# EAGLE schematic Gadget-Box-NodeMCU (EAGLE 6.6.0)

## Sheet 1 of 2
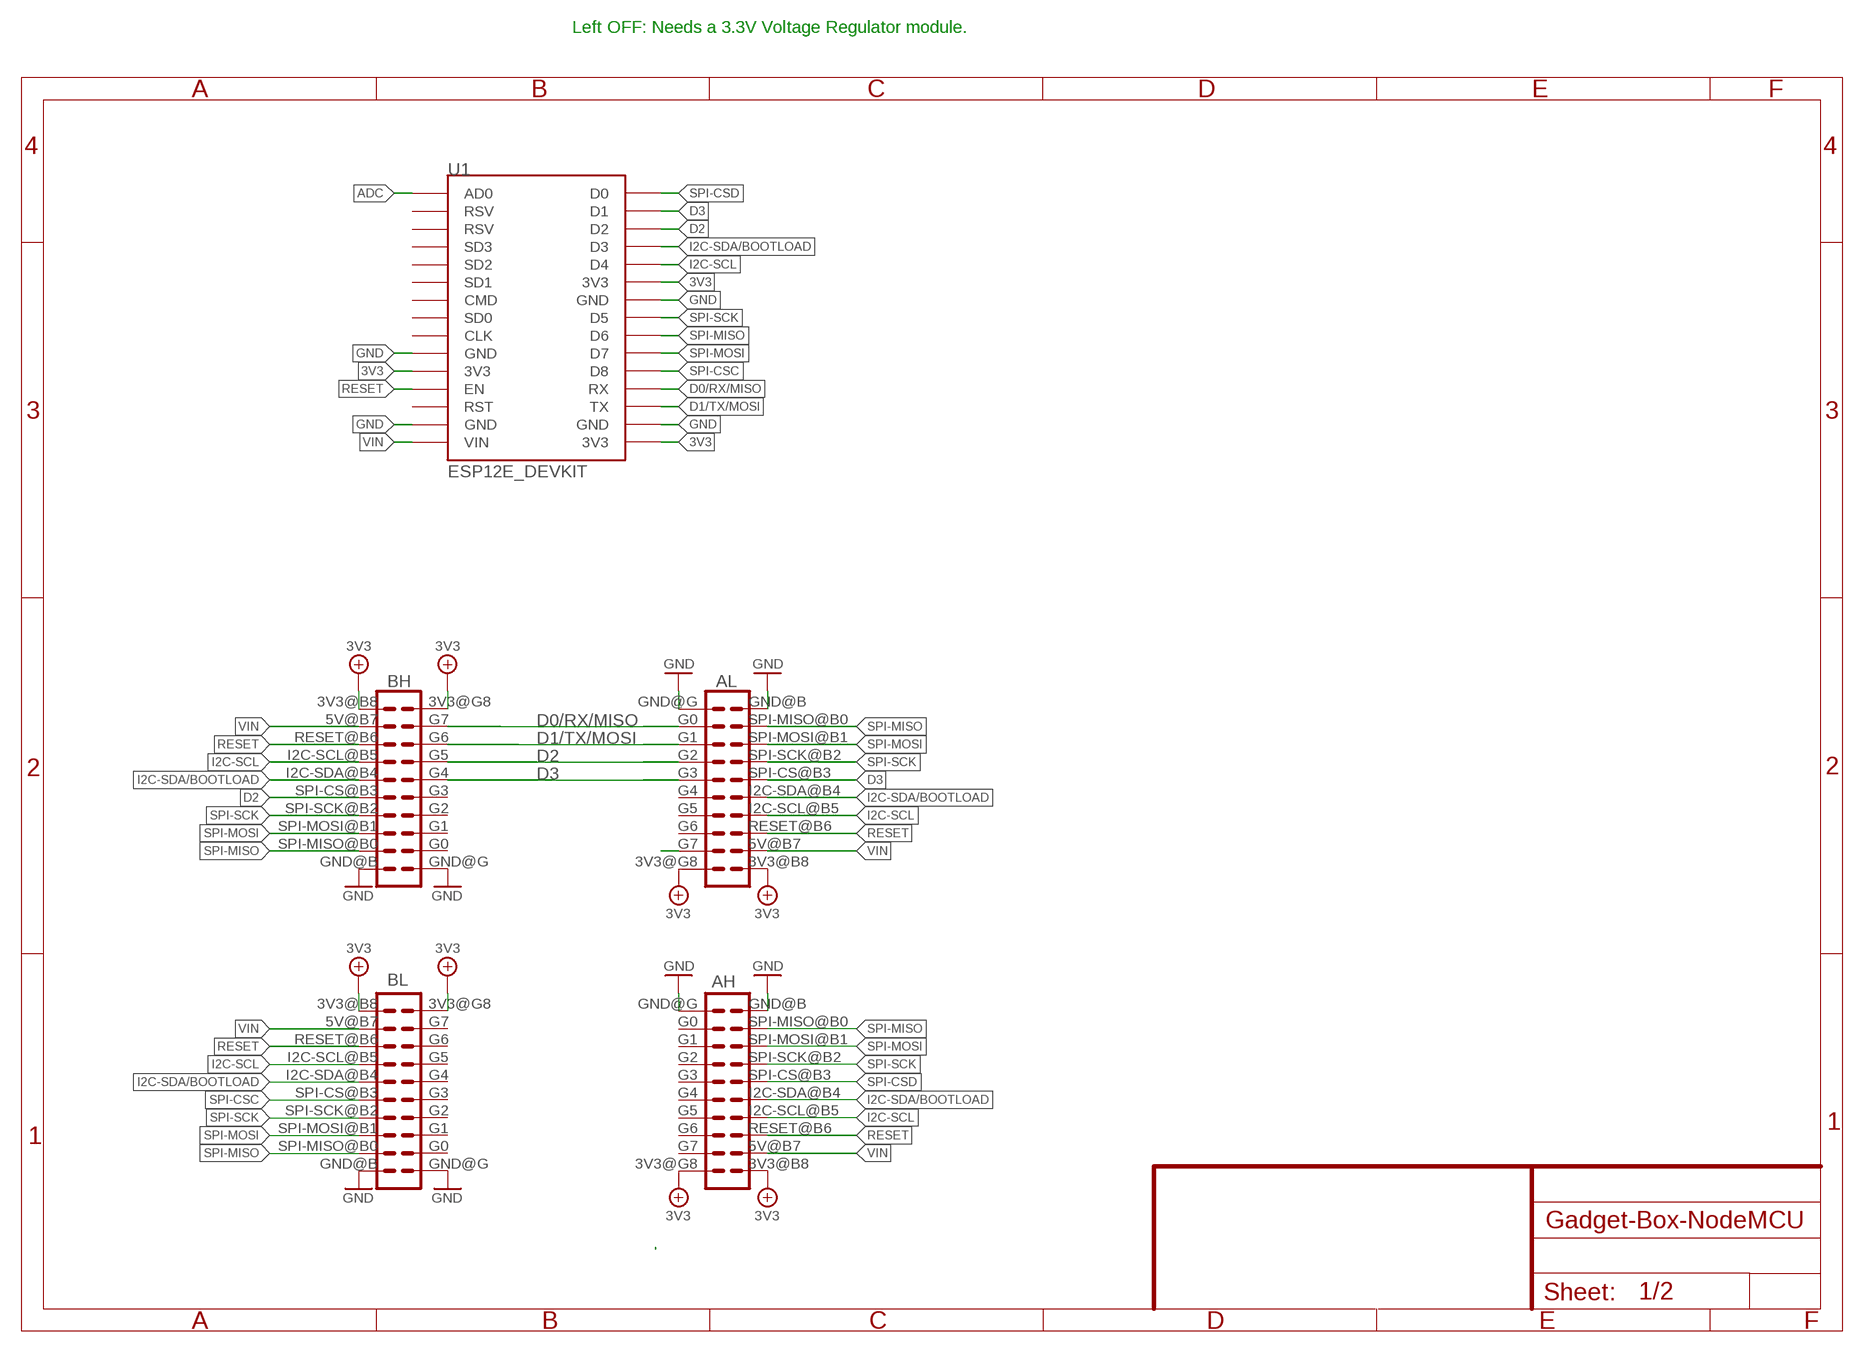
[diagram p0: schematic, sheet 1]

### Parts
AH  ECOGECOG_SLOT  [ECOG]
AL  ECOGECOG_SLOT  [ECOG]
BH  ECOGECOG_SLOT  [ECOG]
BL  ECOGECOG_SLOT  [ECOG]
U1  ESP12E_DEVKIT  [ESP12E_DEVKIT]

### Nets
3V3: AH.3V3@B8(3V3) AH.3V3@G8(3V3) AL.3V3@B8(3V3) AL.3V3@G8(3V3) BH.3V3@B8(3V3) BH.3V3@G8(3V3) BL.3V3@B8(3V3) BL.3V3@G8(3V3) U1.3V3@0(3V3) U1.3V3@1(3V3) U1.3V3@2(3V3)
ADC: U1.AD0 ; also sheet 2
D0/RX/MISO: AL.G0 BH.G7 U1.RX
D1/TX/MOSI: AL.G1 BH.G6 U1.TX
D2: AL.G2 BH.G5 BH.SPI-CS@B3(SPI-CS) U1.D2
D3: AL.G3 AL.SPI-CS@B3(SPI-CS) BH.G4 U1.D1
GND [gnd]: AH.GND@B(GND) AH.GND@G(GND) AL.GND@B(GND) AL.GND@G(GND) BH.GND@B(GND) BH.GND@G(GND) BL.GND@B(GND) BL.GND@G(GND) U1.GND@0(GND) U1.GND@1(GND) U1.GND@2(GND) U1.GND@3(GND) ; also sheet 2
I2C-SCL: AH.I2C-SCL@B5(I2C-SCL) AL.I2C-SCL@B5(I2C-SCL) BH.I2C-SCL@B5(I2C-SCL) BL.I2C-SCL@B5(I2C-SCL) U1.D4
I2C-SDA/BOOTLOAD: AH.I2C-SDA@B4(I2C-SDA) AL.I2C-SDA@B4(I2C-SDA) BH.I2C-SDA@B4(I2C-SDA) BL.I2C-SDA@B4(I2C-SDA) U1.D3
N$5: AL.G7
RESET: AH.RESET@B6(RESET) AL.RESET@B6(RESET) BH.RESET@B6(RESET) BL.RESET@B6(RESET) U1.EN
SPI-CSC: BL.SPI-CS@B3(SPI-CS) U1.D8
SPI-CSD: AH.SPI-CS@B3(SPI-CS) U1.D0
SPI-MISO: AH.SPI-MISO@B0(SPI-MISO) AL.SPI-MISO@B0(SPI-MISO) BH.SPI-MISO@B0(SPI-MISO) BL.SPI-MISO@B0(SPI-MISO) U1.D6
SPI-MOSI: AH.SPI-MOSI@B1(SPI-MOSI) AL.SPI-MOSI@B1(SPI-MOSI) BH.SPI-MOSI@B1(SPI-MOSI) BL.SPI-MOSI@B1(SPI-MOSI) U1.D7
SPI-SCK: AH.SPI-SCK@B2(SPI-SCK) AL.SPI-SCK@B2(SPI-SCK) BH.SPI-SCK@B2(SPI-SCK) BL.SPI-SCK@B2(SPI-SCK) U1.D5
VIN: AH.5V@B7(5V) AL.5V@B7(5V) BH.5V@B7(5V) BL.5V@B7(5V) U1.VIN ; also sheet 2
Unconnected: AH.G0 AH.G1 AH.G2 AH.G3 AH.G4 AH.G5 AH.G6 AH.G7 AL.G4 AL.G5 AL.G6 BH.G0 BH.G1 BH.G2 BH.G3 BL.G0 BL.G1 BL.G2 BL.G3 BL.G4 BL.G5 BL.G6 BL.G7 U1.CLK U1.CMD U1.RST U1.RSV@0(RSV) U1.RSV@1(RSV) U1.SD0 U1.SD1 U1.SD2 U1.SD3

### Notes on the sheet
- Left OFF: Needs a 3.3V Voltage Regulator module.

## Sheet 2 of 2
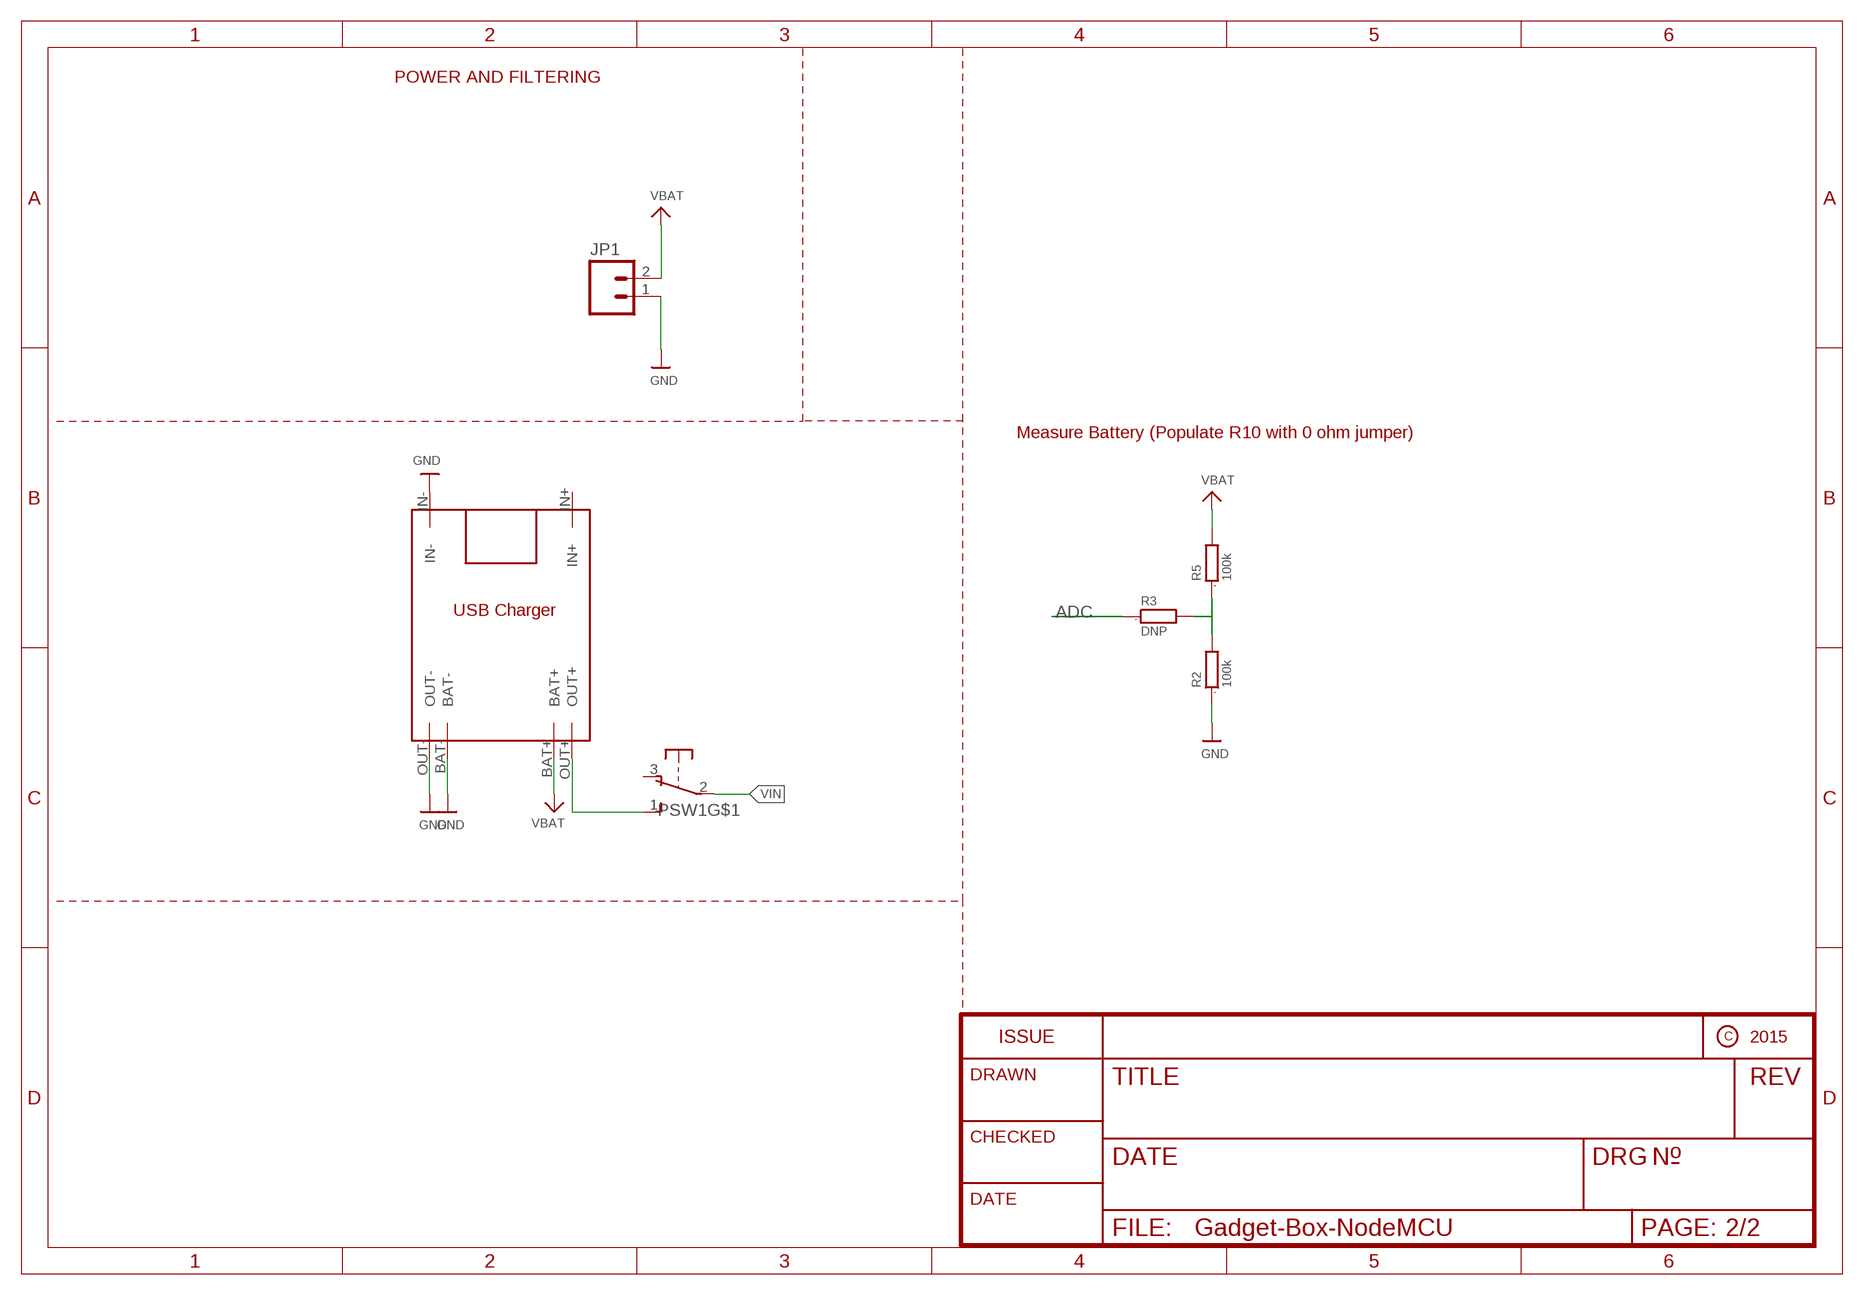
[diagram p1: schematic, sheet 2]

### Parts
JP1  M02-JST-2-PTH-NO_SILK  [JST-2-PTH-NS]
PSW1  OS102011MA1Q  [OS102011MA1Q]
R2  100k  R0603  [0603]
R3  DNP  R0603  [0603]
R5  100k  R0603  [0603]
U$1  TP4056  [TP4056]

### Nets
ADC: R3.1 ; also sheet 1
GND [gnd]: JP1.1 R2.1 U$1.BAT- U$1.IN- U$1.OUT- ; also sheet 1
N$2: R2.2 R3.2 R5.1
N$3: PSW1.1(S) U$1.OUT+
VBAT: JP1.2 R5.2 U$1.BAT+
VIN: PSW1.2(P) ; also sheet 1
Unconnected: PSW1.3(O) PSW1.MT1(MT) PSW1.MT2(MT) U$1.IN+

### Notes on the sheet
- POWER AND FILTERING
- Measure Battery (Populate R10 with 0 ohm jumper)

## Library data of the parts
AH AL BH BL = eCogs:ECOG; PARTNO: PPPC102LFBN-RC,SULLINS CONNECTOR SOLUTIONS,dk,S6106-ND,"CONN HEADER FEM 20POS.1"" DL GOLD", REF67
JP1 = SparkFun:M02: Header 2 Standard 2-pin 0.1" header. Use with straight break away headers (SKU : PRT-00116), right angle break away headers (PRT-00553), swiss pins (PRT-00743), machine pins (PRT-00117), and female headers (PRT-00115). Molex polarized connector foot print use with SKU : PRT-08233 with associated crimp pins and housings.; PARTNO: B2B-PH-SM4-TB(LF)(SN),JST SALES AMERICA INC (VA),dk,455-1734-1-ND ,"2 Positions Header, Shrouded Connector 0.079 (2.00mm) Through Hole Tin ", REF87
PSW1 = adafruit:OS102011MA1Q: OS10201MA1Q through-hole right angle switch http://www.ladyada.net/library/eagle; PARTNO: OS102011MA1QN1,C&K Components,dk,CKN9559-ND,SWITCH SLIDE SPDT 100MA 12V , REF72
R2 R5 = GadgetFactory:R: RESISTOR, European symbol; PARTNO: RC0603JR-07100KL,YAGEO (VA),dk,311-100KGRCT-ND,RES SMD 100K OHM 5% 1/10W 0603 , REF76
R3 = GadgetFactory:R: RESISTOR, European symbol; BOM: EXCLUDE
U1 = ESP12E_DEVKIT:ESP12E_DEVKIT: ESP12E DEVKIT BOARD
U$1 = TP4056 charging module:TP4056

## Net classes
2 gnd: width 0.254 mm, drill 0.381 mm, clearance 0.254 mm
3 usbvcc: width 0.254 mm, drill 0.381 mm, clearance 0.254 mm
4 aref: width 0.254 mm, drill 0.381 mm, clearance 0.254 mm